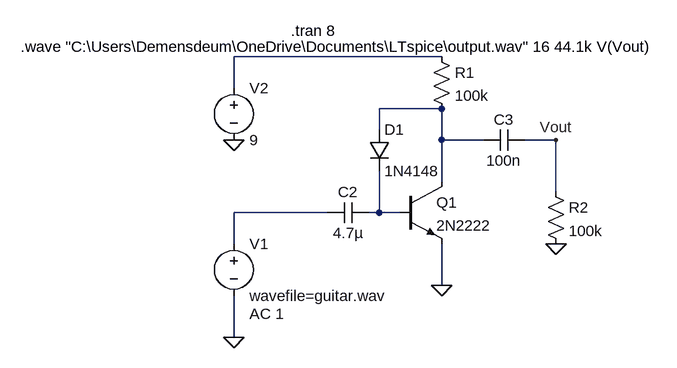
[diagram p0: schematic BassFuzz3.asc]
BassFuzz3.asc, the LTspice schematic file:
Version 4.1
SHEET 1 880 680
WIRE 208 -96 -112 -96
WIRE -112 -48 -112 -96
WIRE 208 -16 112 -16
WIRE 112 16 112 -16
WIRE 208 32 208 -16
WIRE 272 32 208 32
WIRE 384 32 336 32
WIRE 208 96 208 32
WIRE 384 112 384 32
WIRE 32 144 -112 144
WIRE 112 144 112 80
WIRE 112 144 96 144
WIRE 144 144 112 144
WIRE -112 192 -112 144
WIRE 208 256 208 192
WIRE -112 336 -112 272
FLAG 208 256 0
FLAG -112 336 0
FLAG -112 32 0
FLAG 384 192 0
FLAG 384 32 Vout
SYMBOL npn 144 96 R0
SYMATTR InstName Q1
SYMATTR Value 2N2222
SYMBOL cap 96 128 R90
WINDOW 0 0 32 VBottom 2
WINDOW 3 32 32 VTop 2
SYMATTR InstName C2
SYMATTR Value 4.7µ
SYMBOL voltage -112 176 R0
WINDOW 123 24 124 Left 2
SYMATTR InstName V1
SYMATTR Value wavefile=guitar.wav
SYMATTR Value2 AC 1
SYMBOL diode 96 16 R0
SYMATTR InstName D1
SYMATTR Value 1N4148
SYMBOL res 192 -112 R0
SYMATTR InstName R1
SYMATTR Value 100k
SYMBOL voltage -112 -64 R0
WINDOW 123 0 0 Left 0
WINDOW 39 0 0 Left 0
SYMATTR InstName V2
SYMATTR Value 9
SYMBOL cap 336 16 R90
WINDOW 0 0 32 VBottom 2
WINDOW 3 32 32 VTop 2
SYMATTR InstName C3
SYMATTR Value 100n
SYMBOL res 368 96 R0
SYMATTR InstName R2
SYMATTR Value 100k
TEXT -24 -136 Left 2 !.tran 8
TEXT -440 -112 Left 2 !.wave "C:\\Users\\Demensdeum\\OneDrive\\Documents\\LTspice\\output.wav" 16 44.1k V(Vout)

The netlist it stands for:
* BassFuzz3.asc
Q1 N002 N004 0 0 2N2222
C2 N004 N003 4.7µ
V1 N003 0 wavefile=guitar.wav AC 1
D1 N002 N004 1N4148
R1 N001 N002 100k
V2 N001 0 9
C3 Vout N002 100n
R2 Vout 0 100k
.model D D
.lib standard.dio
.model NPN NPN
.model PNP PNP
.lib standard.bjt
.tran 8
.wave "C:\Users\Demensdeum\OneDrive\Documents\LTspice\output.wav" 16 44.1k V(Vout)
.backanno
.end